# EAGLE design ComboSensorBreakout (EAGLE 9.6.2)
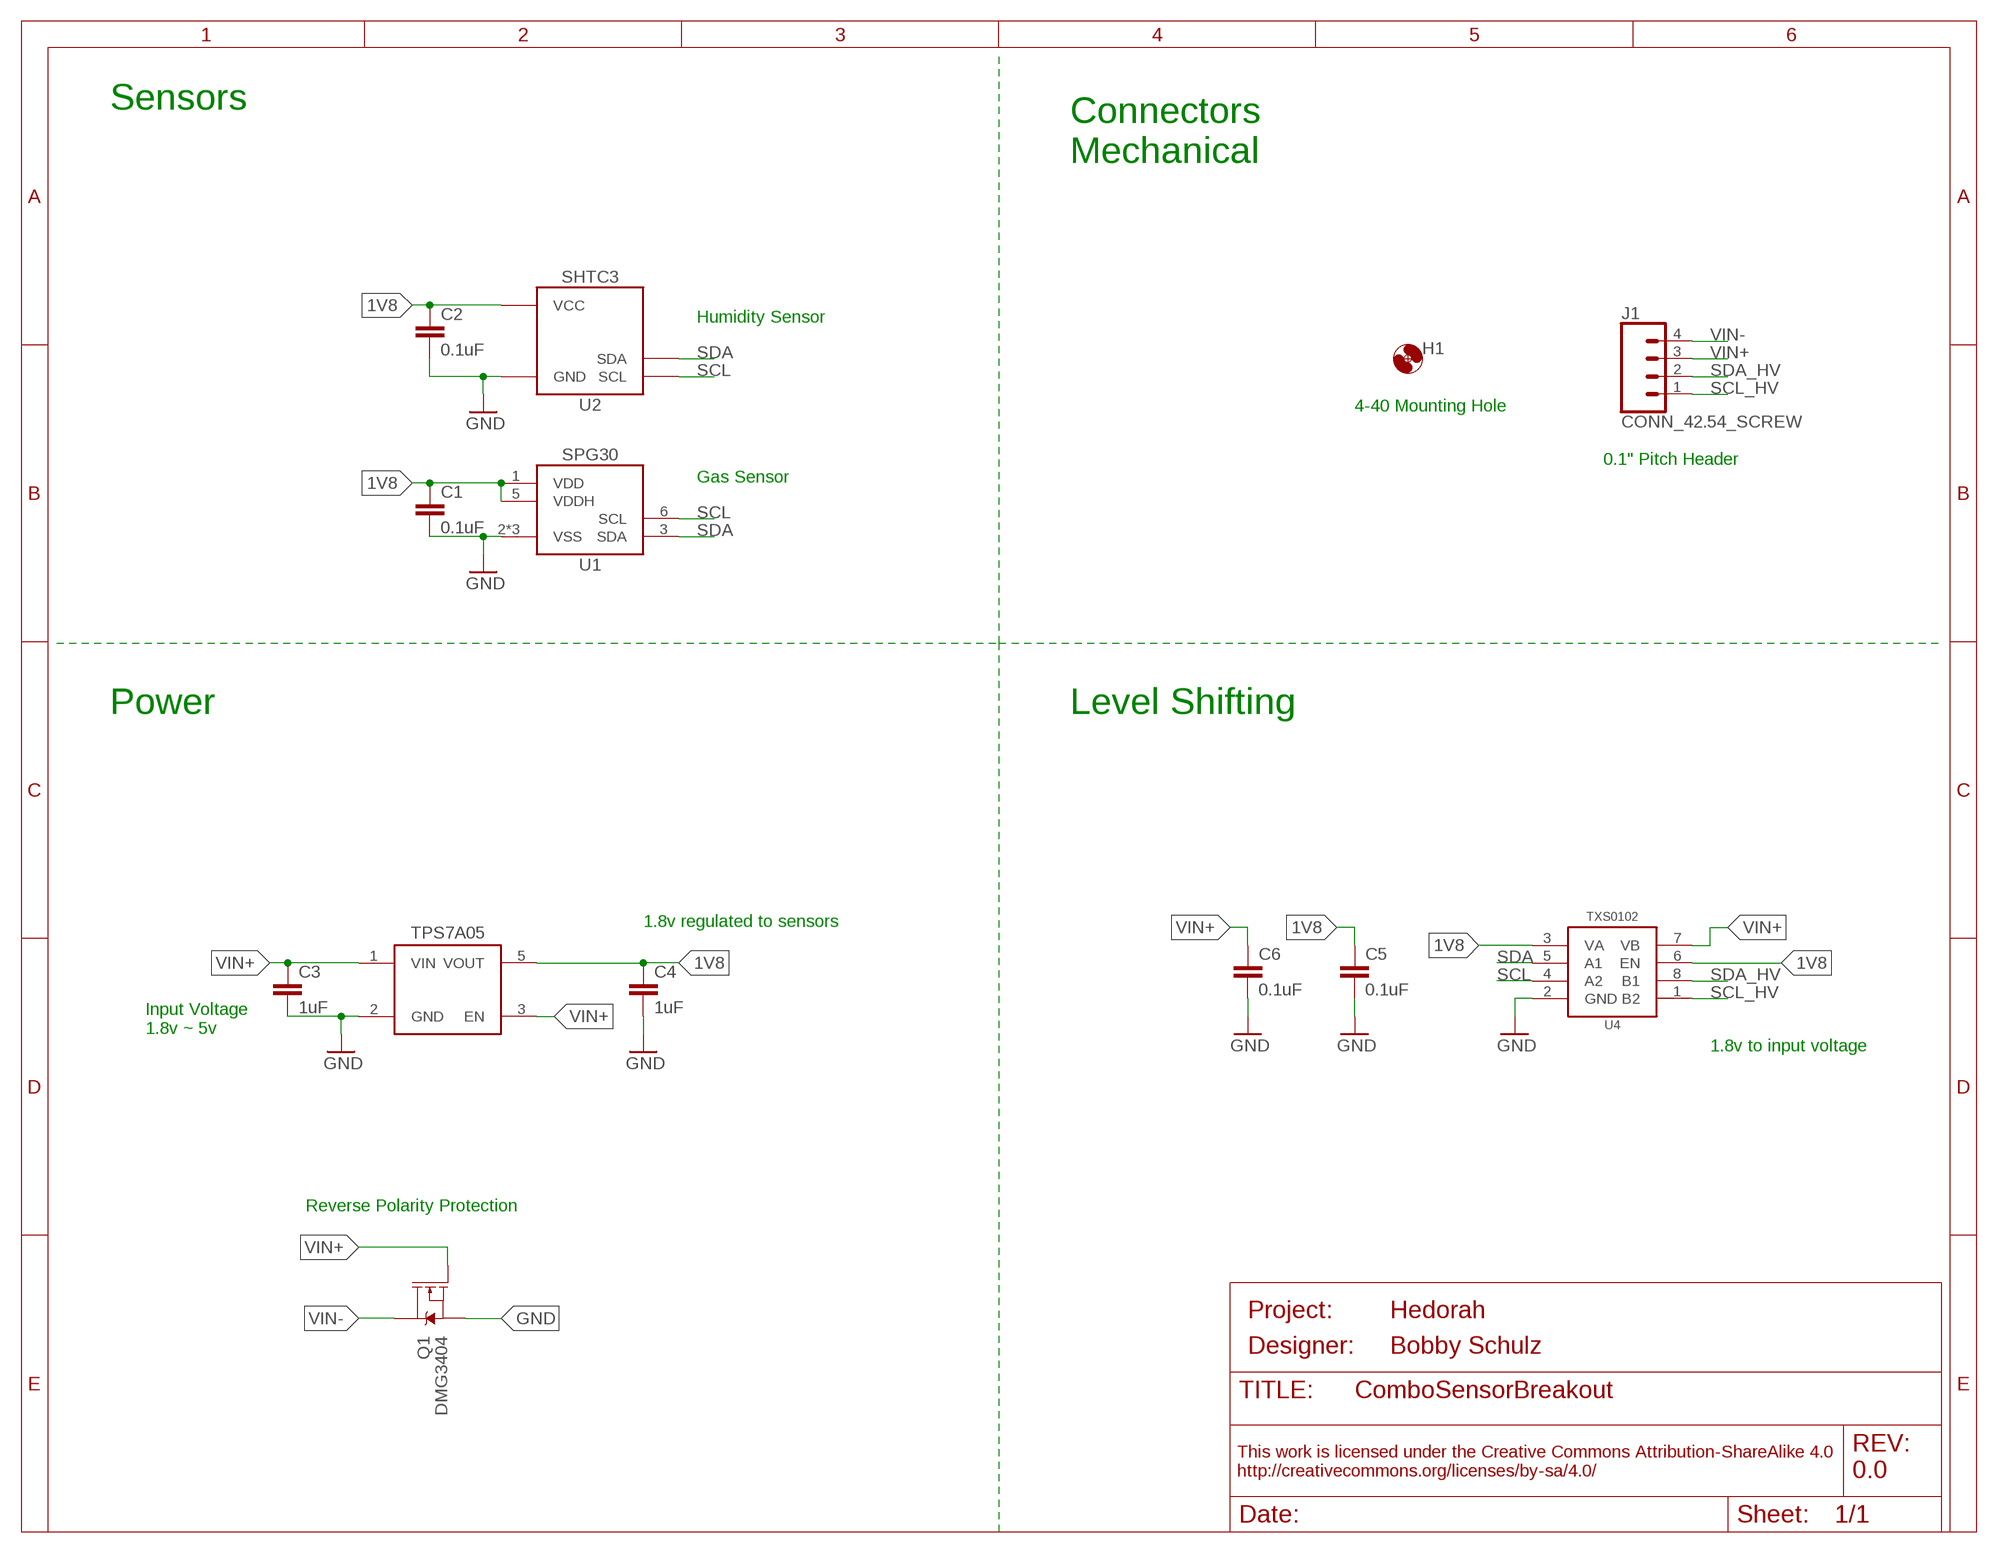
[diagram p0: schematic, sheet 1]
FRAME1 (FRAME_A_L): DESIGNER: Bobby Schulz; PROJECT: Hedorah; REV: 0.0

## Parts
C1  0.1uF  C-EU0.1UFC0603  [C0603]
C2  0.1uF  C-EU0.1UFC0603  [C0603]
C3  1uF  C-EU1UFC0603  [C0603]
C4  1uF  C-EU1UFC0603  [C0603]
C5  0.1uF  C-EU0.1UFC0603  [C0603]
C6  0.1uF  C-EU0.1UFC0603  [C0603]
H1  MOUNTING_HOLE4_NP  [4_40]
J1  CONN_42.54_SCREW  [1X04_SCREW]
Q1  DMG3404  MOSFET-NCH-DMG3404L  [SOT23-3]
U1  SPG30  [DFN_6_2.5X2.5]
U2  SHTC3DFN  [DFN_4_2X2]
U3  TPS7A0518DBV  [SOT23-5]
U4  TXS0102DCU  [DCU_(R-PDSO-G8)]

## Nets
1V8: C1.1 C2.1 C4.1 C5.1 U1.1(VDD) U1.5(VDDH) U2.1(VCC) U3.5(VOUT) U4.3(VA) U4.6(EN)
GND: C1.2 C2.2 C3.2 C4.2 C5.2 C6.2 Q1.2(S) U1.2(VSS) U1.4(VSS) U1.EP(VSS) U2.4(GND) U2.EP(GND) U3.2(GND) U4.2(GND)
SCL: U1.6(SCL) U2.2(SCL) U4.4(A2)
SCL_HV: J1.1 U4.1(B2)
SDA: U1.3(SDA) U2.3(SDA) U4.5(A1)
SDA_HV: J1.2 U4.8(B1)
VIN+: C3.1 C6.1 J1.3 Q1.1(G) U3.1(VIN) U3.3(EN) U4.7(VB)
VIN-: J1.4 Q1.3(D)

## Notes on the sheet
- Sensors
- Connectors
  Mechanical
- Humidity Sensor
- 4-40 Mounting Hole
- 0.1" Pitch Header
- Gas Sensor
- Power | Level Shifting
- 1.8v regulated to sensors
- Input Voltage
  1.8v ~ 5v
- 1.8v to input voltage
- Reverse Polarity Protection

## Library data of the parts
C1 C2 C5 C6 = bschulz_passives:C-EU: CAPACITOR, European symbol; DIGIKEY: 490-6051-1-ND; MF: Murata; MPN: GCM188R71E104KA57D
C3 C4 = bschulz_passives:C-EU: CAPACITOR, European symbol; DIGIKEY: 490-10479-1-ND; MF: Murata; MPN: GRM188R61C105KA12D
H1 = bschulz:MOUNTING_HOLE: Genaric Mechanical Mounting Hole Hole diameter based on max body diameter + 15% Keepout ring is for diameter of socket cap screw (minimum required clearance) TPlace ring is for diameter of pan head screw (recomended clearance) Specifications: Socket Cap <http://fastener-express.com/fastener-technical/SocketscapSS-Alloy.pdf> Button Head Socket Cap <http://fastener-express.com/fastener-technical/Button-Socket-alloy.pdf> Pan Head <http://fastener-express.com/fastener-technical/pan-machine-Screws.pdf>; DIGIKEY: DNP; MF: N/A; MPN: DNP
J1 = bschulz:CONN_4: Genaric 4 terminal header Digikey 2.54_SCREW <https://www.digikey.com/product-detail/en/on-shore-technology-inc/OSTVN04A150/ED10563-ND/1588864>; DIGIKEY: ED10563-ND; MF: On Shore; MPN: OSTVN04A150
Q1 = bschulz:MOSFET-NCH: N-channel MOSFETs Voltage controlled devices that allow control of high current outputs. SparkFun Products: SparkFun OpenScale <https://www.sparkfun.com/products/13261> SparkFun Digital Sandbox <https://www.sparkfun.com/products/12651> SparkFun Monster Moto Shield <https://www.sparkfun.com/products/10182> SparkFun MOSFET Power Controller <https://www.sparkfun.com/products/11214>; DIGIKEY: DMG3404L-7DICT-ND; MF: Diodes Incorporated; MPN: DMG3404L-7
U1 = bschulz:SPG30: SGP30 - Multi-pixel Gas Sensor (TVOC, CO2EQ) Characteristics: Vcc: 1.8V Gas Sensing: Ethanol, H2, TVOC, CO2eq Sample Rate: 1Hz (Air Quality), 40Hz (Gas) Operating Temperature: -40°C to 85°C Digikey: 1649-1084-1-ND <https://www.digikey.com/product-detail/en/sensirion-ag/SGP30-2.5K/1649-1084-1-ND/7400967>; DIGIKEY: 1649-1084-1-ND; MF: Sensirion; MPN: SGP30-2.5K
U2 = bschulz:SHTC*: SHTCx - Digital Humidity and Temperature Sensor Characteristics (for SHTC3): Vcc: 1.62V ~ 3.6V Humidity Resolution: 0.01% RH Humidity Accuracy: ±2% RH Temperature Resolution: 0.01°C Temperature Accuracy: 0.2°C Operating Temperature: -40°C to 125°C Digikey: 1649-1100-1-ND (SHTC3) <https://www.digikey.com/product-detail/en/sensirion-ag/SHTC3/1649-1100-1-ND/8628149> 1649-1015-1-ND (SHTC1) <https://www.digikey.com/product-detail/en/sensirion-ag/SHTC1/1649-1015-1-ND/5872297>; DIGIKEY: 1649-1100-1-ND; DISP: SHTC3; MF: Sensirion; MPN: SHTC3
U3 = bschulz:TPS7A05*: TPS7A05* - Ultra Low Power Low Dropout Linear Regulator Characteristics: Vin: 1.4V ~ 5.5V Vout: 0.8, 1.0, 1.2, 1.5, 1.8, 2.5, 2.85, 3.3V fixed IQ: 1μA typ, 3μA max Voltage Accuracy: 1% typ, 3% max Output Current: 200 mA Operating Temperature: -40°C to 125°C Mouser: TPS7A0533 (3.3V Fixed) <https://www.mouser.com/ProductDetail/Texas-Instruments/TPS7A0533PDBVR?qs=sGAEpiMZZMsGz1a6aV8DcD1rpA6FsR3J1Mp5DdTpiXw%3d> TPS7A0518 (1.8V Fixed) <https://www.mouser.com/ProductDetail/Texas-Instruments/TPS7A0518PDBVR?qs=sGAEpiMZZMsGz1a6aV8DcD1rpA6FsR3J1f7DNYacdSI%3d>; DIGIKEY: 296-50251-1-ND; MF: TI; MOUSER: 595-TPS7A0518PDBVR; MPN: TPS7A0518PDBVR
U4 = bschulz:TXS0102: TXS0102 - 2 Channel Bidirectional Voltage Level Translator Characteristics: Vcc: 1.65 ~ 3.6V (Port A), 2.3 ~ 5.5V (Port B) IQ: 14.4μA Output Current: 50mA Output Type: Open Drain/Push-Pull Operating Temperature: -40°C to 85°C Digikey: 296-28368-1-ND (DQE) <https://www.digikey.com/product-detail/en/texas-instruments/TXS0102DQER/296-28368-1-ND/2625893> 296-28435-1-ND (DQM) <https://www.digikey.com/product-detail/en/texas-instruments/TXS0102DQMR/296-28435-1-ND/2638910> 296-21931-1-ND (DCU) <https://www.digikey.com/product-detail/en/texas-instruments/TXS0102DCUR/296-21931-1-ND/1629284>; DIGIKEY: 296-21931-1-ND; MF: TI; MPN: TXS0102DCUR

## Board
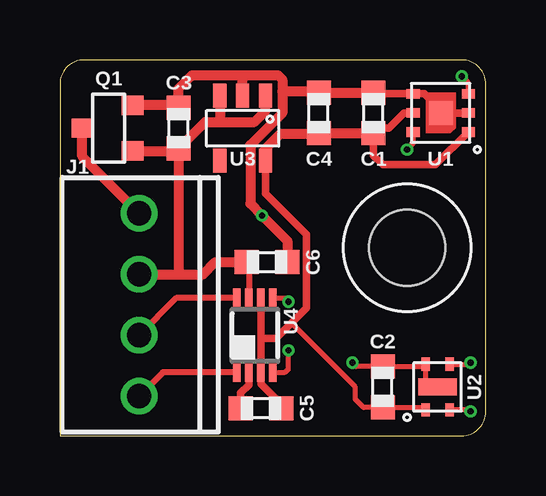
[diagram p1: board, top side]
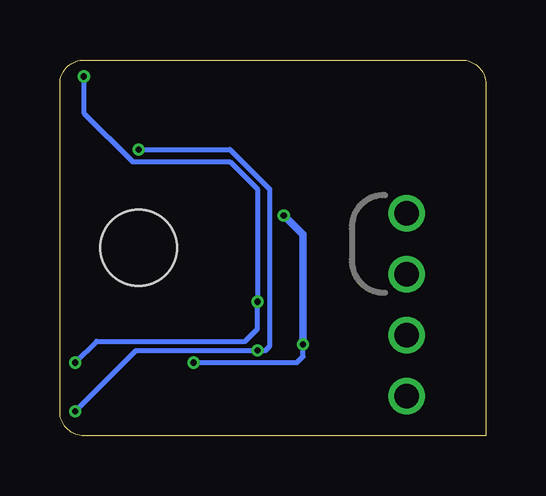
[diagram p2: board, bottom side, seen from below]

Size 17.76 x 15.67 mm. Coordinates in mm from the lower left corner, seen from the top.
Outline: 0,0 16.76,0 arc90 17.76,1 17.76,14.67 arc90 16.76,15.67 1,15.67 arc90 0,14.67 0,0
Copper layers (1*16): Top 0.035559375mm / dielectric 1.6mm / Bottom 0.035559375mm
Design rules "oshpark-2layer": minimum track width 6mil, minimum drill 10mil, track to track 6mil, track to pad 6mil, pad to pad 6mil, via to via 6mil, smd to smd 6mil, copper to edge 15mil, drill to drill 6mil, minimum pad ring 5mil, minimum via ring 5mil, stop-mask expansion 2.5mil, vias tented up to drill 0mil, thermal gap 10mil

### Footprints (pad centres in the part's own frame; a part is rotated, then mirrored left to right if it is on the bottom)
C0603 = smd 1 x 1: 1 -0.85,0; 2 0.85,0
4_40 = hole 3.175: 0,0
1X04_SCREW = drill 1.016: 1 -3.81,0; 2 -1.27,0; 3 1.27,0; 4 3.81,0
SOT23-3 = smd 0.8 x 0.9: 1 -0.95,-1; 2 0.95,-1; 3 0,1.1
DFN_6_2.5X2.5 = smd 0.55 x 0.4: 1 -1.15,0.8; 2 -1.15,0; 3 -1.15,-0.8; 4 1.15,-0.8; 5 1.15,0; 6 1.15,0.8 | smd 1 x 1: EP 0,0
DFN_4_2X2 = smd 0.55 x 0.35: 1 -0.95,0.5; 2 -0.95,-0.5; 3 0.95,-0.5; 4 0.95,0.5 | smd 0.7 x 1.6: EP 0,0
SOT23-5 = smd 0.55 x 1: 1 -0.95,-1.35; 2 0,-1.35; 3 0.95,-1.35; 4 0.95,1.35; 5 -0.95,1.35
DCU_(R-PDSO-G8) = smd 0.3 x 0.8: 1 -0.75,-1.55; 2 -0.25,-1.55; 3 0.25,-1.55; 4 0.75,-1.55; 5 0.75,1.55; 6 0.25,1.55; 7 -0.25,1.55; 8 -0.75,1.55

### Placement (x,y rotation side)
C1  13.08,13.46 90 top
C2  13.46,2.03 90 top
C3  4.95,12.83 90 top
C4  10.79,13.46 90 top
C5  8.38,1.14 180 top
C6  8.64,7.24 0 top
H1  14.48,7.84 0 top
J1  3.3,5.46 90 top
Q1  2.03,12.83 90 top
U1  15.88,13.46 180 top
U2  15.75,2.03 90 top
U3  7.62,12.83 180 top
U4  8.13,4.19 0 top

### Tracks (layer width: path | path; a pad name or v marks a point on that pad's centre or on a via)
1V8
  Top 0.2: 9.65,4.7 12.32,2.03 12.32,1.52 12.66,1.18 C2.1 15.15,1.18 U2.1
  Top 0.305: C1.1 13.21,12.61 | U1.1 15.67,11.3 13.46,11.3 13.08,11.68 C1.1 | U3.5 8.57,10.1 10.29,8.38 10.29,7.87 10.29,5.34 9.65,4.7 9.02,4.06 8.38,4.06 | U4.6 8.38,4.06 | 8.38,4.06 U4.3 8.38,2.16 9.23,1.31 C5.1 | C1.1 13.12,12.57 | U1.5 14.35,13.46 13.72,12.83 13.3,12.83 C1.1
  Top 0.406: C1.1 C4.1 10.76,12.57 9.18,12.57 8.57,11.96 U3.5
GND  (via drill 0.25)
  Top 0.2: C2.2 12.36,2.88 v12.19,3.05 | 13.56,2.98 C2.2 | C2.2 15.15,2.88 U2.4 15.25,2.04 15.11,1.91 15.62,1.91 U2.EP
  Top 0.305: C1.2 13.1,14.33 13.17,14.26 U1.4 15.2,14.26 16,13.46 | U1.2 16,13.46 | 16,13.46 U1.EP | C5.2 7.53,1.78 7.88,2.12 U4.2 7.88,3.55 v7.62,3.81 | 9.53,7.2 C6.2
  Top 0.406: Q1.2 4.85,13.78 C3.2 4.95,14.48 5.51,15.03 7.62,15.03 | U3.2 7.62,15.03 | C1.2 C4.2 10.76,14.35 9.27,14.35 | 9.27,14.35 9.27,13.46 7.94,12.12 7.94,9.68 v8.43,9.19 9.49,8.13 C6.2 | 7.62,15.03 9.1,15.03 9.27,14.86 9.27,14.35
  Bottom 0.2: v7.62,3.81 7.62,3.3 7.87,3.05 v12.19,3.05
  Bottom 0.305: v8.43,9.19 7.62,8.38 v7.62,3.81
SCL  (via drill 0.25)
  Top 0.2: U1.6 14.72,12.19 v14.48,11.94 | U4.4 9.39,2.64 9.53,2.78 v9.53,3.55 | v17.12,1.02 17.06,1.08 U2.2
  Bottom 0.2: v17.12,1.02 14.59,3.55 v9.53,3.55 9.19,3.55 9.02,3.73 9.02,10.29 10.67,11.94 v14.48,11.94
SCL_HV
  Top 0.254: U4.1 4.29,2.64 J1.1
SDA  (via drill 0.25)
  Top 0.2: U1.3 17.02,14.72 v16.76,14.99 | U4.5 9.37,5.74 v9.53,5.59 | v17.12,3.05 17.06,2.98 U2.3
  Bottom 0.2: v17.12,3.05 16.24,3.94 10.03,3.94 9.53,4.45 v9.53,5.59 9.53,10.29 10.67,11.43 14.73,11.43 16.76,13.46 v16.76,14.99
SDA_HV
  Top 0.254: U4.8 4.85,5.74 J1.2
VIN+
  Top 0.254: C6.1 7.88,7.15 U4.7
  Top 0.406: Q1.1 4.85,11.88 C3.1 | J1.3 4.83,6.73 | 4.83,6.73 5.97,6.73 6.48,7.24 C6.1 | 4.83,6.73 4.95,6.86 C3.1 | C3.1 6.06,13.08 6.6,13.08 | U3.3 6.67,13.15 6.6,13.08 | 6.6,13.08 8.11,13.08 8.57,13.54 U3.1
VIN-
  Top 0.406: J1.4 0.93,11.64 Q1.3

### Text on the board
tDocu: Vin- | Vin+ | SDA | SCL
bDocu: Project Hedorah v0.0 / Bobby Schulz | Vin- | ± | Vin+ | To Logger / 1.8v ~ 5v | SDA | SCL